# EAGLE design Spring Terminal Large Pushbutton v0.2.1 (EAGLE 7.3.0)
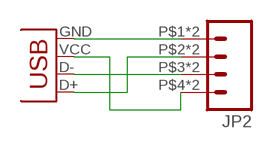
[diagram p0: schematic, sheet 1]

## Parts
JP1  USBMICROB-GCT-USB3075  [USB-MICROB-GCT-USB3075]
JP2  M04LARGE_PUSHBTN_SPRING_TERM  [1X04_LARGE_PUSHBTN_SPRING_TERM]

## Nets
3V3: JP1.VCC(VBUS) JP2.P$4 JP2.P$5
D+: JP1.D+ JP2.P$2 JP2.P$7
D-: JP1.D- JP2.P$3 JP2.P$6
GND: JP1.GND JP2.P$1 JP2.P$8

## Library data of the parts
JP1 = comingle:USB
JP2 = comingle:M04: Header 4 Standard 4-pin 0.1" header. Use with straight break away headers (SKU : PRT-00116), right angle break away headers (PRT-00553), swiss pins (PRT-00743), machine pins (PRT-00117), and female headers (PRT-00115). Molex polarized connector foot print use with SKU : PRT-08231 with associated crimp pins and housings. 1MM SMD Version SKU: PRT-10208

## Board
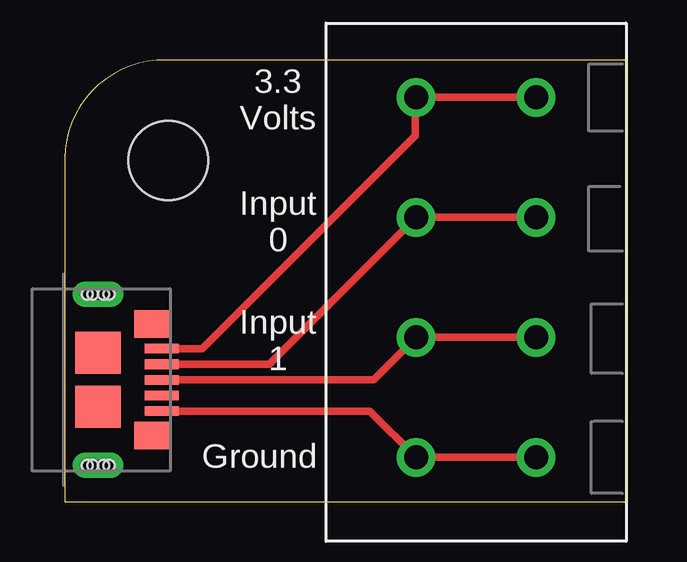
[diagram p1: board, top side]
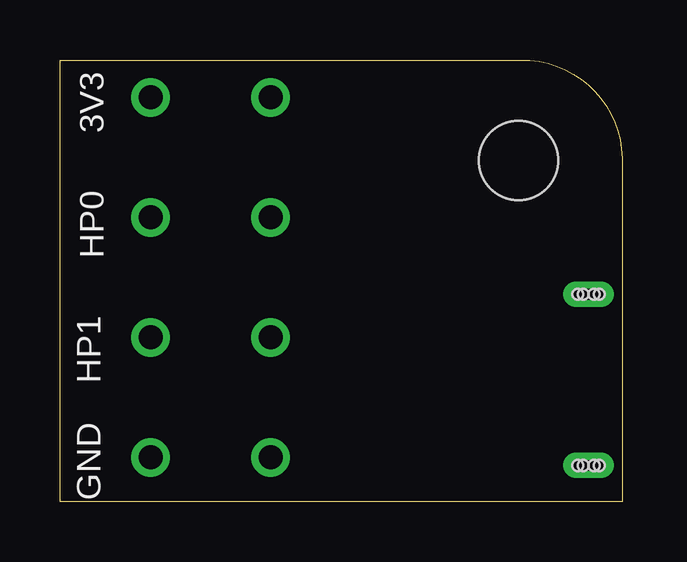
[diagram p2: board, bottom side, seen from below]

Size 23.42 x 18.41 mm. Coordinates in mm from the lower left corner, seen from the top.
Outline: 4.22,18.41 23.42,18.41 23.42,0 0,0 0,14.32 arc-90 4.22,18.41
Outline: 4.3,18.4 4.22,18.41
Copper layers (1*16): Top 0.035mm / dielectric 1.5mm / Bottom 0.035mm
Design rules "SparkFun-2-layer": minimum track width 7mil, minimum drill 15mil, track to track 8mil, track to pad 8mil, pad to pad 8mil, via to via 8mil, smd to smd 8mil, copper to edge 8mil, drill to drill 8mil, minimum pad ring 12mil, minimum via ring 10mil, stop-mask expansion 4mil, vias tented up to drill 20mil, thermal gap 10mil

### Footprints (pad centres in the part's own frame; a part is rotated, then mirrored left to right if it is on the bottom)
USB-MICROB-GCT-USB3075 = smd 0.4 x 1.4: D+ 0,2.65; D- -0.65,2.65; GND 1.3,2.65; ID 0.65,2.65; VCC -1.3,2.65 | smd 1.75 x 1.9: P$1 -1.125,0; P$2 1.125,0 | drill 0.45 pad 1.05 long: P$3 -3.57,0; P$4 3.57,0 | smd 1.15 x 1.45: P$5 -2.32,2.23; P$6 2.32,2.23 | hole 0.45: -3.57,0.225; -3.57,0.45; -3.57,-0.45; -3.57,-0.225; 3.57,0.225; 3.57,0.45; 3.57,-0.45; 3.57,-0.225
1X04_LARGE_PUSHBTN_SPRING_TERM = drill 1: P$1 -7.3,2.5; P$2 -2.3,2.5; P$3 2.7,2.5; P$4 7.7,2.5; P$5 7.7,-2.5; P$6 2.7,-2.5; P$7 -2.3,-2.5; P$8 -7.3,-2.5
STAND-OFF = hole 3.302: 0,0

### Placement (x,y rotation side)
JP1  1.4,5.08 270 top
JP2  17.14,9.14 90 top
U$1  [STAND-OFF]  4.32,14.22 0 top

### Tracks (layer width: path | path; a pad name or v marks a point on that pad's centre or on a via)
3V3
  Top 0.305: JP1.VCC 5.75,6.38 14.61,15.24 14.61,16.8 JP2.P$4 JP2.P$5
D+
  Top 0.305: JP1.D+ 12.88,5.08 JP2.P$2 JP2.P$7
D-
  Top 0.305: JP1.D- 8.53,5.73 JP2.P$3 JP2.P$6
GND
  Top 0.305: JP1.GND 12.71,3.78 JP2.P$1 JP2.P$8

### Text on the board
tPlace: 3.3 / Volts | Input / 0 | Input / 1 | Ground
bPlace: 3V3 | HP0 | HP1 | GND